# Altium schematic sheet CR99003.SchDoc
size A4; Organization: Trenz Electronic GmbH; Revision: 01; SheetNumber: 1; SheetTotal: 1
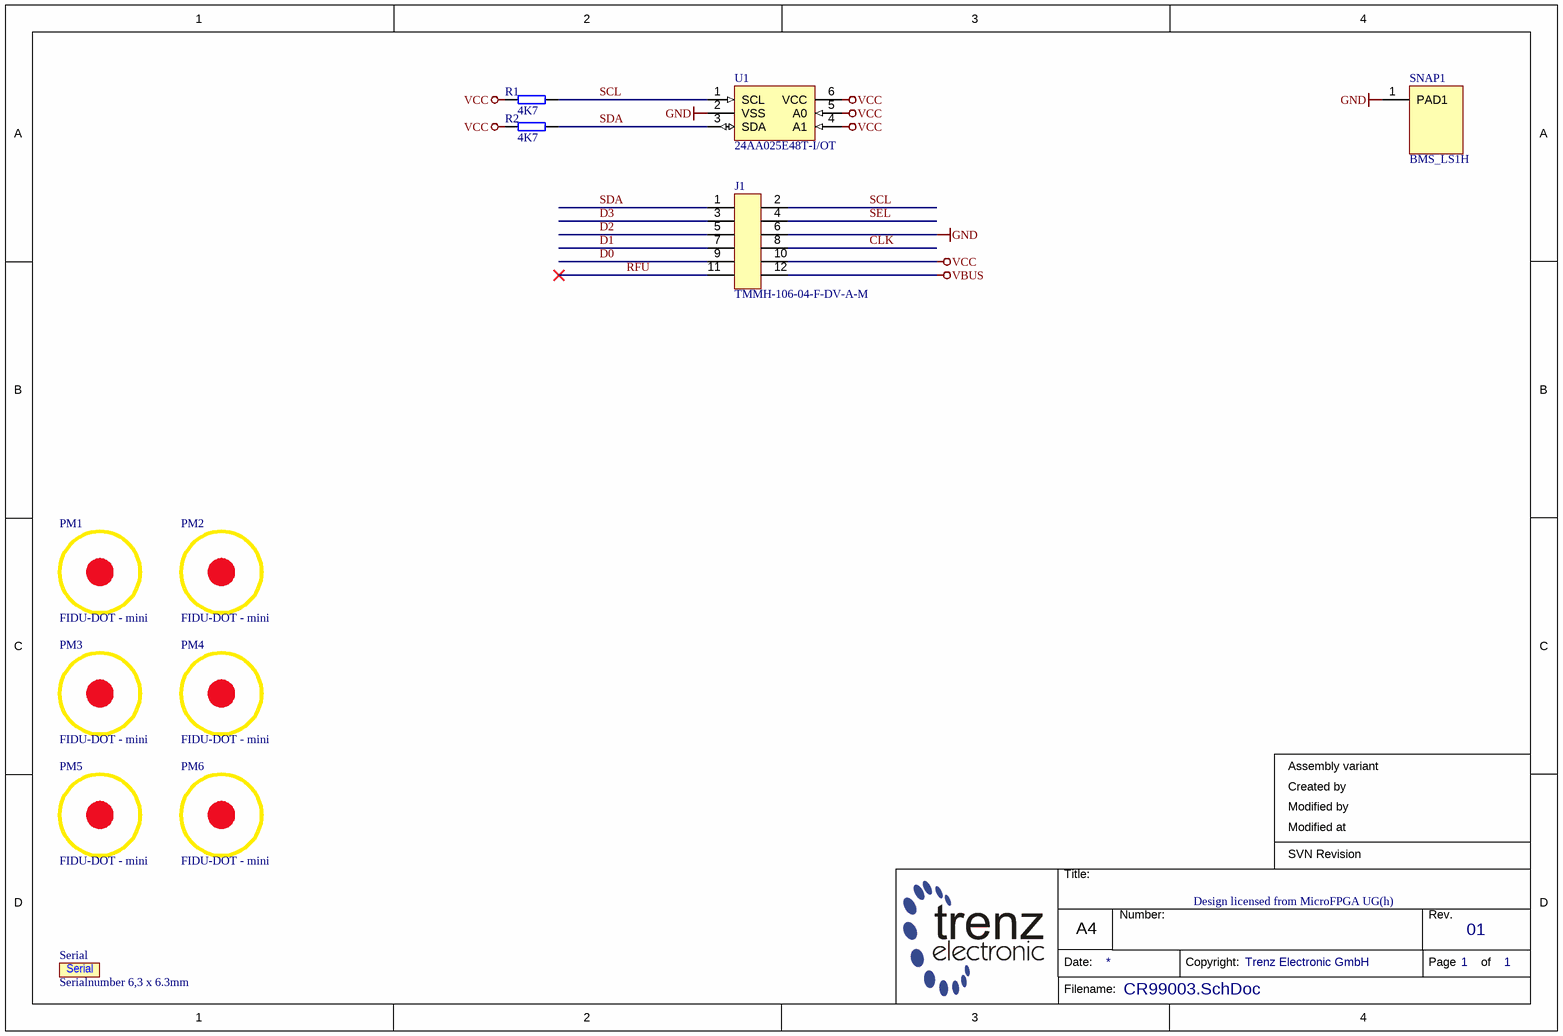
[diagram p0: CR99003.SchDoc]

## Parts
J1  TMMH-106-04-F-DV-A-M  [TMMH-106-04-T-DV-A]
PM1  FIDU-DOT - mini  [FIDU-DOT - mini]
PM2  FIDU-DOT - mini  [FIDU-DOT - mini]
PM3  FIDU-DOT - mini  [FIDU-DOT - mini]
PM4  FIDU-DOT - mini  [FIDU-DOT - mini]
PM5  FIDU-DOT - mini  [FIDU-DOT - mini]
PM6  FIDU-DOT - mini  [FIDU-DOT - mini]
R1  4K7  [RESC1005X40N_V]
R2  4K7  [RESC1005X40N_V]
Serial  Serialnumber 6,3 x 6.3mm  [Serial_6.3x6.3mm]  (no BOM)
SNAP1  BMS_LS1H  [BMS_LS1H]  (no BOM)
U1  24AA025E48T-I/OT  [SOT95P280X145-6N]

## Nets
GND: J1.6 SNAP1.1(PAD1) U1.2(VSS)
VBUS: J1.12
VCC: J1.10 R1.1 R2.1 U1.4(A1) U1.5(A0) U1.6(VCC)
CLK: J1.8
D0: J1.9
D1: J1.7
D2: J1.5
D3: J1.3
RFU: J1.11
SCL: J1.2 R1.2 U1.1(SCL)
SDA: J1.1 R2.2 U1.3(SDA)
SEL: J1.4

## Notes on the sheet
- Assembly variant
- Created by
- Modified at
- Modified by
- Design licensed from MicroFPGA UG(h)
- SVN Revision
- Title:
- Number:
- Rev.
- Date:
- A4
- Copyright:
- Page
- of
- Filename:

## Library data of the parts
J1 = 28976: AN: 28976; Mixed: SMT; Extra: 12 pin 1.91mm 2  mm SMT Header; HelpURL: b:\AD\adlib\datasheet\Samtec_TMMH\; H-ART: TMMH-106-04-F-DV-A-M
PM1-PM6 = 27037: FIDU-DOT - MINI 0.5mm; AN: 27037; Mixed: FIDU
R1 R2 = 22585: WID SMD 4K7 1% 0,063W BF 1005 (0402); AN: 22585; Mixed: SMT; Value: 4.7K; Preferred: Yes; H-ART: RC0402FR-134K7L; Tolerance: 1%; Case: 1005 (0402); Technology: TK100
Serial = 26753: AN: 26753; H-ART: 39068; Mixed: MECH; Extra: THT-70-718-20
U1 = 26249: AN: 26249; Mixed: SMT; Temperature-Range: -40/+85; Extra: 2K i2c Serial EEPROM with EUI-48; Case: SOT23-6; HelpURL: B:\AD\adlib\datasheet\24AA02xExx; H-ART: 24AA025E48T-I/OT